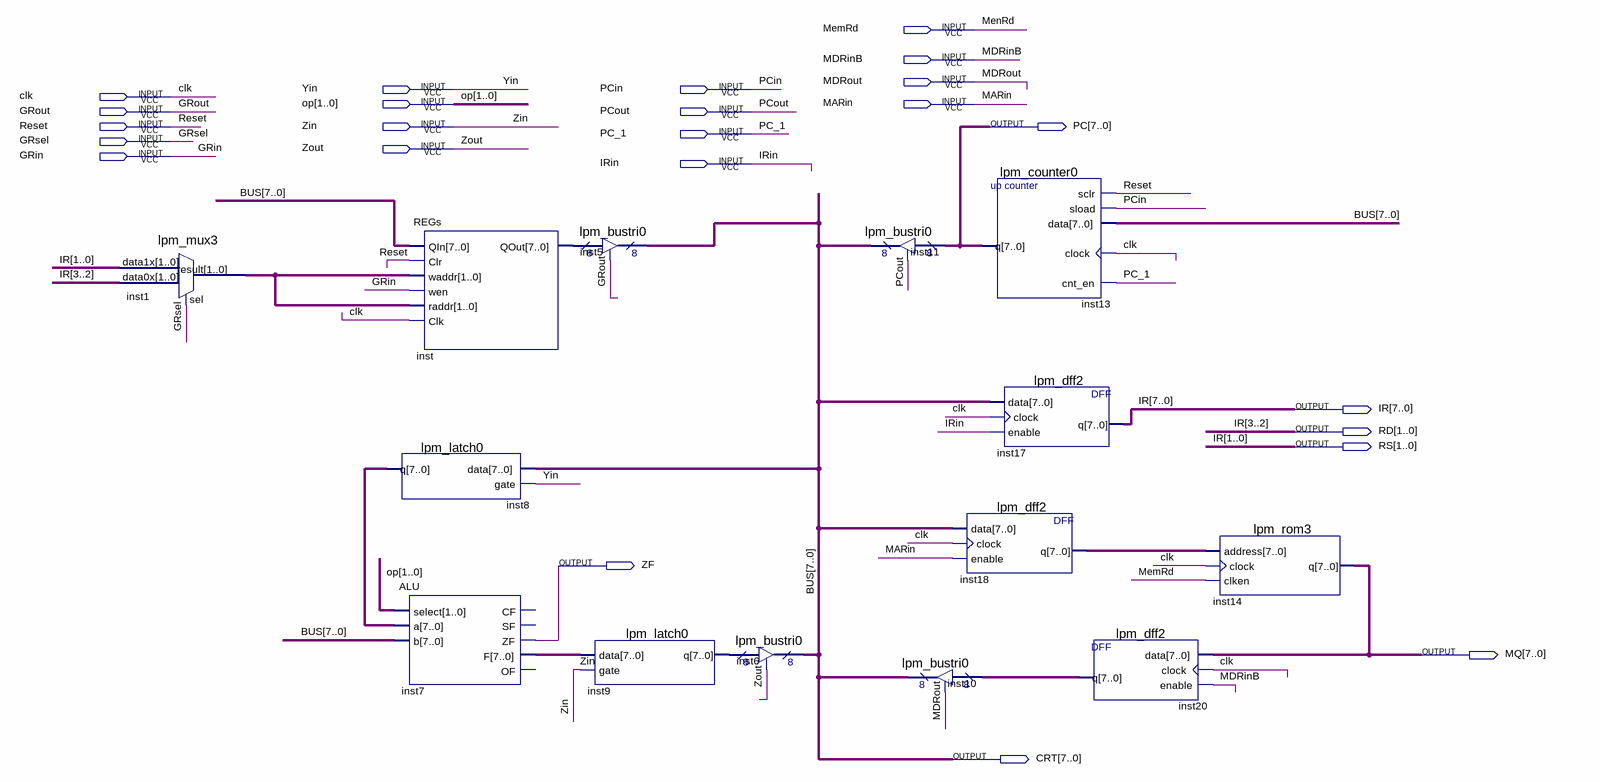
[diagram p0: schematic sheet]
// Quartus schematic DEMO_IS.bdf as structural Verilog: 14 symbols, 24 pins
module DEMO_IS (
  input  MemRd,
  input  MDRinB,
  input  MDRout,
  input  Yin,
  input  PCin,
  input  clk,
  input  [1:0] op,
  input  MARin,
  input  GRout,
  input  PCout,
  input  Reset,
  input  Zin,
  input  PC_1,
  input  GRsel,
  input  Zout,
  input  GRin,
  input  IRin,
  output [7:0] PC,
  output [7:0] IR,
  output [1:0] RD,
  output [1:0] RS,
  output ZF,
  output [7:0] MQ,
  output [7:0] CRT
);

  wire [1:0] inst1_result;
  wire [7:0] inst7_f, inst8_q, inst9_q, inst18_q, inst20_q, inst_qout;

  lpm_mux3 inst1 (.data1x(IR[1:0]), .data0x(IR[3:2]), .sel(GRsel), .result(inst1_result));
  REGs inst (
    .QIn(CRT), .Clr(Reset), .waddr(inst1_result), .wen(GRin), .raddr(inst1_result), .Clk(clk),
    .QOut(inst_qout));
  lpm_latch0 inst8 (.data(CRT), .gate(Yin), .q(inst8_q));
  ALU inst7 (.select(op), .a(inst8_q), .b(CRT), .ZF(ZF), .F(inst7_f));  // open: CF, SF, OF
  lpm_bustri0 inst5 (.enabledt(GRout), .data(inst_qout), .tridata(CRT));
  lpm_latch0 inst9 (.data(inst7_f), .gate(Zin), .q(inst9_q));
  lpm_bustri0 inst6 (.enabledt(Zout), .data(inst9_q), .tridata(CRT));
  lpm_bustri0 inst11 (.enabledt(PCout), .data(PC), .tridata(CRT));
  lpm_dff2 inst18 (.data(CRT), .clock(clk), .enable(MARin), .q(inst18_q));
  lpm_bustri0 inst10 (.enabledt(MDRout), .data(inst20_q), .tridata(CRT));
  lpm_counter0 inst13 (.sclr(Reset), .sload(PCin), .data(CRT), .clock(clk), .cnt_en(PC_1), .q(PC));
  lpm_dff2 inst17 (.data(CRT), .clock(clk), .enable(IRin), .q(IR));
  lpm_dff2 inst20 (.data(MQ), .clock(clk), .enable(MDRinB), .q(inst20_q));
  lpm_rom3 inst14 (.address(inst18_q), .clock(clk), .clken(MemRd), .q(MQ));

  assign RD = IR[3:2];
  assign RS = IR[1:0];

  // Other names for the same wires on the sheet: BUS[7:0] = CRT; MenRd = MemRd
endmodule
